# EAGLE design nes-forever (EAGLE 7.7.0)
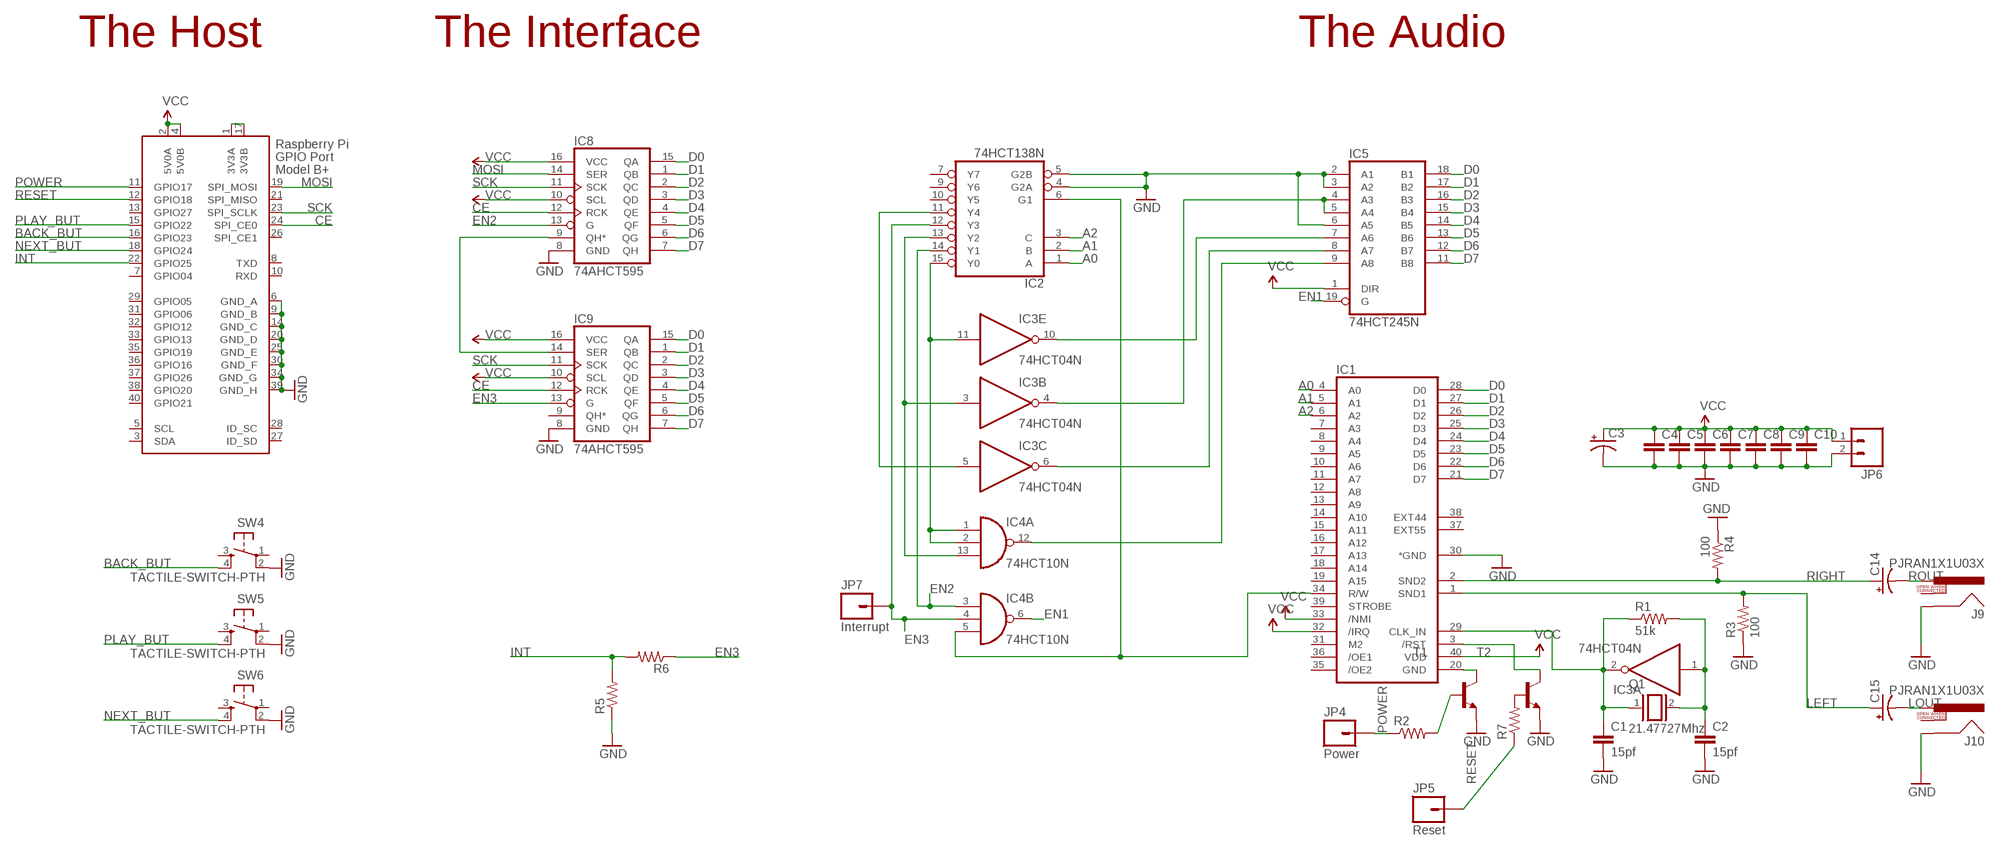
[diagram p0: schematic, sheet 1]

## Parts
C1  15pf  C-EU025-024X044  [C025-024X044]
C2  15pf  C-EU025-024X044  [C025-024X044]
C3  CPOL-USE5-8.5  [E5-8,5]
C4  C-EU025-024X044  [C025-024X044]
C5  C-EU025-024X044  [C025-024X044]
C6  C-EU025-024X044  [C025-024X044]
C7  C-EU025-024X044  [C025-024X044]
C8  C-EU025-024X044  [C025-024X044]
C9  C-EU025-024X044  [C025-024X044]
C10  C-EU025-024X044  [C025-024X044]
C14  CPOL-USE2-4  [E2-4]
C15  CPOL-USE2-4  [E2-4]
IC1  2A03  [DIL40]
IC2  74HCT138N  [DIL16]
IC3  74HCT04N  [DIL14]
IC4  74HCT10N  [DIL14]
IC5  74HCT245N  [DIL20]
IC8  74AHCT595  74LS595N  [DIL16]
IC9  74AHCT595  74LS595N  [DIL16]
J9  PJRAN1X1U03X  RCA  [RCA]
J10  PJRAN1X1U03X  RCA  [RCA]
JP4  Power  M01PTH  [1X01]
JP5  Reset  M01PTH  [1X01]
JP6  M02  [1X02_LONGPADS]
JP7  Interrupt  M01PTH  [1X01]
Q1  21.47727Mhz  XTAL  [Q]
R1  51k  R-US_0207/7  [0207/7]
R2  R-US_0207/7  [0207/7]
R3  100  R-US_0207/7  [0207/7]
R4  100  R-US_0207/7  [0207/7]
R5  R-US_0207/7  [0207/7]
R6  R-US_0207/7  [0207/7]
R7  R-US_0207/7  [0207/7]
SW4  TACTILE-SWITCH-PTH  [TAC-SWITCH-PTH]
SW5  TACTILE-SWITCH-PTH  [TAC-SWITCH-PTH]
SW6  TACTILE-SWITCH-PTH  [TAC-SWITCH-PTH]
T1  2N2222-NPN-TO92-EBC  [TO92-EBC]
T2  2N2222-NPN-TO92-EBC  [TO92-EBC]
X2  RASPI_BOARD_B+#_E4  [RASPI_BOARD_B+_EDGES_4DRILL]

## Nets
3.3V [Power]: X2.1(3V3A) X2.17(3V3B)
A0: IC1.4(A0) IC2.1(A)
A1: IC1.5(A1) IC2.2(B)
A2: IC1.6(A2) IC2.3(C)
A3: IC3.4(B:O) IC5.4(A3) IC5.5(A4)
BACK_BUT: SW4.4 X2.16(GPIO23)
CE: IC8.12(RCK) IC9.12(RCK) X2.24(SPI_CE0)
D0: IC1.28(D0) IC5.18(B1) IC8.15(QA) IC9.15(QA)
D1: IC1.27(D1) IC5.17(B2) IC8.1(QB) IC9.1(QB)
D2: IC1.26(D2) IC5.16(B3) IC8.2(QC) IC9.2(QC)
D3: IC1.25(D3) IC5.15(B4) IC8.3(QD) IC9.3(QD)
D4: IC1.24(D4) IC5.14(B5) IC8.4(QE) IC9.4(QE)
D5: IC1.23(D5) IC5.13(B6) IC8.5(QF) IC9.5(QF)
D6: IC1.22(D6) IC5.12(B7) IC8.6(QG) IC9.6(QG)
D7: IC1.21(D7) IC5.11(B8) IC8.7(QH) IC9.7(QH)
EN1: IC4.6(B:O) IC5.19(G)
EN2: IC2.14(Y1) IC4.3(B:I0) IC8.13(G)
EN3: IC2.12(Y3) IC4.4(B:I1) IC9.13(G) JP7.1 R6.1
GND [Power]: C1.2 C2.2 C3.- C4.2 C5.2 C6.2 C7.2 C8.2 C9.2 C10.2 IC1.30(*GND) IC2.4(G2A) IC2.5(G2B) IC5.2(A1) IC5.3(A2) IC5.6(A5) IC8.8(GND) IC9.8(GND) J9.SHELL J10.SHELL JP6.2 R3.1 R4.1 R5.1 SW4.2 SW5.2 SW6.2 T1.E T2.E X2.6(GND_A) X2.9(GND_B) X2.14(GND_C) X2.20(GND_D) X2.25(GND_E) X2.30(GND_F) X2.34(GND_G) X2.39(GND_H)
INT: R5.2 R6.2 X2.22(GPIO25)
LEFT: C15.+ IC1.1(SND1) R3.2
LOUT: C15.- J10.PIN
MOSI: IC8.14(SER) X2.19(SPI_MOSI)
N$1: IC3.10(E:O) IC5.7(A6)
N$2: R7.2 T2.B
N$3: IC3.6(C:O) IC5.8(A7)
N$4: IC2.15(Y0) IC3.11(E:I) IC4.1(A:I0) IC4.2(A:I1)
N$5: IC4.12(A:O) IC5.9(A8)
N$6: IC2.13(Y2) IC3.3(B:I) IC4.13(A:I2)
N$8: IC2.11(Y4) IC3.5(C:I)
N$9: IC1.34(R/W) IC2.6(G1) IC4.5(B:I2)
N$26: IC1.20(GND) T1.C
N$27: R2.2 T1.B
N$28: C1.1 IC1.29(CLK_IN) IC3.2(A:O) Q1.1 R1.1
N$29: C2.1 IC3.1(A:I) Q1.2 R1.2
N$31: IC1.3(/RST) T2.C
N$32: IC8.9(QH*) IC9.14(SER)
NEXT_BUT: SW6.4 X2.18(GPIO24)
PLAY_BUT: SW5.4 X2.15(GPIO22)
POWER: JP4.1 R2.1 X2.11(GPIO17)
RESET: JP5.1 R7.1 X2.12(GPIO18)
RIGHT: C14.+ IC1.2(SND2) R4.2
ROUT: C14.- J9.PIN
SCK: IC8.11(SCK) IC9.11(SCK) X2.23(SPI_SCLK)
VCC [Power]: C3.+ C4.1 C5.1 C6.1 C7.1 C8.1 C9.1 C10.1 IC1.32(/IRQ) IC1.33(/NMI) IC1.40(VDD) IC5.1(DIR) IC8.10(SCL) IC8.16(VCC) IC9.10(SCL) IC9.16(VCC) JP6.1 X2.2(5V0A) X2.4(5V0B)
Unconnected: IC1.7(A3) IC1.8(A4) IC1.9(A5) IC1.10(A6) IC1.11(A7) IC1.12(A8) IC1.13(A9) IC1.14(A10) IC1.15(A11) IC1.16(A12) IC1.17(A13) IC1.18(A14) IC1.19(A15) IC1.31(M2) IC1.35(/OE2) IC1.36(/OE1) IC1.37(EXT55) IC1.38(EXT44) IC1.39(STROBE) IC2.7(Y7) IC2.9(Y6) IC2.10(Y5) IC3.8(D:O) IC3.9(D:I) IC3.12(F:O) IC3.13(F:I) IC4.8(C:O) IC4.9(C:I0) IC4.10(C:I1) IC4.11(C:I2) IC9.9(QH*) J9.SWITCH J10.SWITCH SW4.1 SW4.3 SW5.1 SW5.3 SW6.1 SW6.3 X2.3(SDA) X2.5(SCL) X2.7(GPIO04) X2.8(TXD) X2.10(RXD) X2.13(GPIO27) X2.21(SPI_MISO) X2.26(SPI_CE1) X2.27(ID_SD) X2.28(ID_SC) X2.29(GPIO05) X2.31(GPIO06) X2.32(GPIO12) X2.33(GPIO13) X2.35(GPIO19) X2.36(GPIO16) X2.37(GPIO26) X2.38(GPIO20) X2.40(GPIO21)

## Notes on the sheet
- The Host | The Interface | The Audio

## Power pins joined to a net without a drawn wire
GND: IC2.8(GND) IC3.7(P:GND) IC4.7(P:GND) IC5.10(GND)
VCC: IC2.16(VCC) IC3.14(P:VCC) IC4.14(P:VCC) IC5.20(VCC)

## Library data of the parts
C1 C2 C4-C10 = rcl:C-EU: CAPACITOR, European symbol
C3 = rcl:CPOL-US: POLARIZED CAPACITOR, American symbol
C14 C15 = resistor:CPOL-US: POLARIZED CAPACITOR, American symbol
IC1 = nin:2A03: MICROCONTROLLER
IC2 = 74xx-eu:74*138: 3-line to 8-line DECODER/DEMULTIPLEXER
IC3 = 74xx-eu:74*04: Hex INVERTER
IC4 = 74xx-eu:74*10: Triple 3-input NAND gate
IC5 = 74xx-eu:74*245: Octal BUS TRANSCEIVER, 3-state
IC8 IC9 = SparkFun-DigitalIC:74*595: 8-bit SHIFT REGISTER, output latch
J9 J10 = SparkFun-Connectors:RCA
JP4 JP5 JP7 = SparkFun:M01: Header 1 Standard 1-pin 0.1" header. Use with straight break away headers (SKU : PRT-00116), right angle break away headers (PRT-00553), swiss pins (PRT-00743), machine pins (PRT-00117), and female headers (PRT-00115).
JP6 = SparkFun:M02: Header 2 Standard 2-pin 0.1" header. Use with straight break away headers (SKU : PRT-00116), right angle break away headers (PRT-00553), swiss pins (PRT-00743), machine pins (PRT-00117), and female headers (PRT-00115). Molex polarized connector foot print use with SKU : PRT-08233 with associated crimp pins and housings.
Q1 = special:XTAL: CRYSTAL
R1-R7 = resistor:R-US_: RESISTOR, American symbol
SW4-SW6 = GeekAmmo:TACTILE-SWITCH: Tactile Switch 4 Pins, SPST NO
T1 T2 = transistor-neu-to92:*-NPN-: NPN Transistror
X2 = raspberrypi_bastelstube_v13:RASPI_BOARD_B+#: Raspberry Pi GPIO connector with markings for the outer dimensions of the Raspberry Pi board model B+ with different sets of drill holes or mounting pads All pins connected

## Net classes
1 Power: width 0.305 mm

## Board
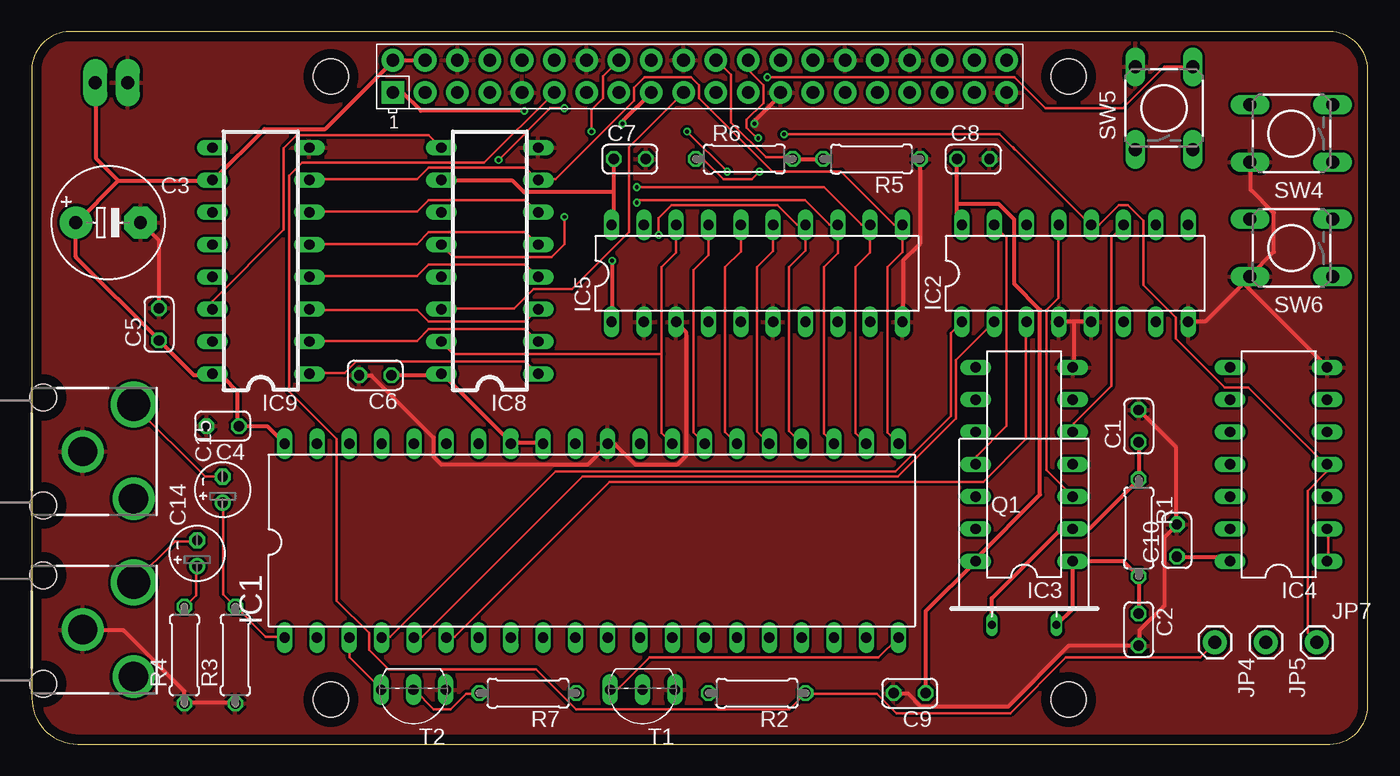
[diagram p1: board, top side]
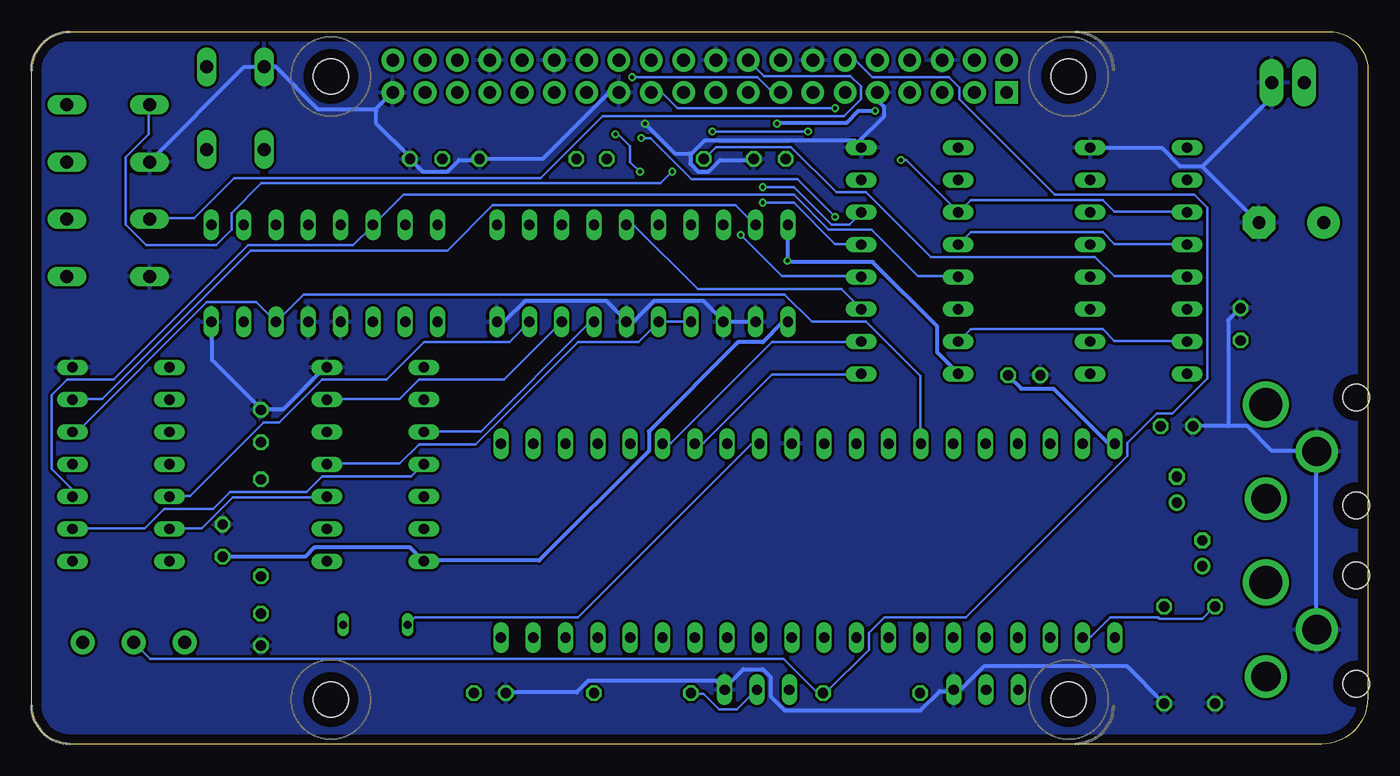
[diagram p2: board, bottom side, seen from below]

Size 105 x 56 mm. Coordinates in mm from the lower left corner, seen from the top.
Outline: 102,56 3,56 arc90 0,53 0,3.61 arc90 3.61,0 102,0 arc90 105,3 105,53 arc90 102,56
Copper layers (1*16): Top 0.035mm / dielectric 1.5mm / Bottom 0.035mm
Design rules "MF_Standard_2_Layer *": minimum track width 8mil, minimum drill 12mil, track to track 8mil, track to pad 8mil, pad to pad 8mil, via to via 8mil, smd to smd 0mil, copper to edge 30mil, drill to drill 30mil, minimum pad ring 6mil, minimum via ring 6mil, stop-mask expansion 2mil, vias tented up to drill 25mil, thermal gap 10mil

### Footprints (pad centres in the part's own frame; a part is rotated, then mirrored left to right if it is on the bottom)
C025-024X044 = drill 0.813 octagon: 1 -1.27,0; 2 1.27,0
E5-8,5 = drill 1.016 pad 2.54: + -2.54,0 | drill 1.016 pad 2.54 octagon: - 2.54,0
E2-4 = drill 0.813 pad 1.27: + -1.016,0 | drill 0.813 pad 1.27 octagon: - 1.016,0
DIL40 = drill 0.813 long: 1 -24.13,-7.62; 2 -21.59,-7.62; 3 -19.05,-7.62; 4 -16.51,-7.62; 5 -13.97,-7.62; 6 -11.43,-7.62; 7 -8.89,-7.62; 8 -6.35,-7.62; 9 -3.81,-7.62; 10 -1.27,-7.62; 11 1.27,-7.62; 12 3.81,-7.62; 13 6.35,-7.62; 14 8.89,-7.62; 15 11.43,-7.62; 16 13.97,-7.62; 17 16.51,-7.62; 18 19.05,-7.62; 19 21.59,-7.62; 20 24.13,-7.62; 21 24.13,7.62; 22 21.59,7.62; 23 19.05,7.62; 24 16.51,7.62; 25 13.97,7.62; 26 11.43,7.62; 27 8.89,7.62; 28 6.35,7.62; 29 3.81,7.62; 30 1.27,7.62; 31 -1.27,7.62; 32 -3.81,7.62; 33 -6.35,7.62; 34 -8.89,7.62; 35 -11.43,7.62; 36 -13.97,7.62; 37 -16.51,7.62; 38 -19.05,7.62; 39 -21.59,7.62; 40 -24.13,7.62
DIL16 = drill 0.813 long: 1 -8.89,-3.81; 2 -6.35,-3.81; 3 -3.81,-3.81; 4 -1.27,-3.81; 5 1.27,-3.81; 6 3.81,-3.81; 7 6.35,-3.81; 8 8.89,-3.81; 9 8.89,3.81; 10 6.35,3.81; 11 3.81,3.81; 12 1.27,3.81; 13 -1.27,3.81; 14 -3.81,3.81; 15 -6.35,3.81; 16 -8.89,3.81
DIL14 = drill 0.813 long: 1 -7.62,-3.81; 2 -5.08,-3.81; 3 -2.54,-3.81; 4 0,-3.81; 5 2.54,-3.81; 6 5.08,-3.81; 7 7.62,-3.81; 8 7.62,3.81; 9 5.08,3.81; 10 2.54,3.81; 11 0,3.81; 12 -2.54,3.81; 13 -5.08,3.81; 14 -7.62,3.81
DIL20 = drill 0.813 long: 1 -11.43,-3.81; 2 -8.89,-3.81; 3 -6.35,-3.81; 4 -3.81,-3.81; 5 -1.27,-3.81; 6 1.27,-3.81; 7 3.81,-3.81; 8 6.35,-3.81; 9 8.89,-3.81; 10 11.43,-3.81; 11 11.43,3.81; 12 8.89,3.81; 13 6.35,3.81; 14 3.81,3.81; 15 1.27,3.81; 16 -1.27,3.81; 17 -3.81,3.81; 18 -6.35,3.81; 19 -8.89,3.81; 20 -11.43,3.81
RCA = drill 2.6: PIN 4,3.7 | drill 2.3: SHELL 0,0; SWITCH 4,-3.7 | hole 2.1: -3.1,4.25; -3.1,-4.25
1X01 = drill 1.016 pad 1.88: 1 0,0
1X02_LONGPADS = drill 1.016 pad 1.88 long: 1 0,0; 2 2.54,0
Q = drill 0.61 long: 1 -2.54,-7.62; 2 2.54,-7.62
0207/7 = drill 0.813 octagon: 1 -3.81,0; 2 3.81,0
TAC-SWITCH-PTH = drill 1.016 pad 1.524 long: 1 -3.251,2.261; 2 3.251,2.261; 3 -3.251,-2.261; 4 3.251,-2.261
TO92-EBC = drill 0.813 long: B 0,-1.27; C 2.54,-1.27; E -2.54,-1.27
RASPI_BOARD_B+_EDGES_4DRILL = drill 1 pad 1.778 square: 1 8.37,51.23 | drill 1 pad 1.778: 2 8.37,53.77; 3 10.91,51.23; 4 10.91,53.77; 5 13.45,51.23; 6 13.45,53.77; 7 15.99,51.23; 8 15.99,53.77; 9 18.53,51.23; 10 18.53,53.77; 11 21.07,51.23; 12 21.07,53.77; 13 23.61,51.23; 14 23.61,53.77; 15 26.15,51.23; 16 26.15,53.77; 17 28.69,51.23; 18 28.69,53.77; 19 31.23,51.23; 20 31.23,53.77; 21 33.77,51.23; 22 33.77,53.77; 23 36.31,51.23; 24 36.31,53.77; 25 38.85,51.23; 26 38.85,53.77; 27 41.39,51.23; 28 41.39,53.77; 29 43.93,51.23; 30 43.93,53.77; 31 46.47,51.23; 32 46.47,53.77; 33 49.01,51.23; 34 49.01,53.77; 35 51.55,51.23; 36 51.55,53.77; 37 54.09,51.23; 38 54.09,53.77; 39 56.63,51.23; 40 56.63,53.77 | hole 2.75: 3.5,3.5; 3.5,52.5; 61.5,3.5; 61.5,52.5

### Placement (x,y rotation side)
C1  87,25 90 top
C2  87,9 270 top
C3  6,41 0 top
C4  15,25 180 top
C5  10,33 90 top
C6  27,29 180 top
C7  47,46 0 top
C8  74,46 0 top
C9  69,4 180 top
C10  90,16 90 top
C14  13,15 90 top
C15  15,20 90 top
IC1  44,16 0 top
IC2  82,37 0 top
IC3  78,22 90 top
IC4  98,22 90 top
IC5  57,37 0 top
IC8  36,38 90 top
IC9  18,38 90 top
J9  4,9 0 top
J10  4,23 0 top
JP4  93,8 270 top
JP5  97,8 270 top
JP6  5,52 0 top
JP7  101,8 0 top
Q1  78,17 0 top
R1  87,17 270 top
R2  57,4 180 top
R3  16,7 90 top
R4  12,7 90 top
R5  66,46 180 top
R6  56,46 0 top
R7  39,4 180 top
SW4  99,48 180 top
SW5  89,50 90 top
SW6  99,39 180 top
T1  48,3 180 top
T2  30,3 180 top
X2  20,0 0 top

### Tracks (layer width: path | path; a pad name or v marks a point on that pad's centre or on a via)
3.3V  (via drill 0.3)
  Top 0.305: v38.71,49.78 30.58,49.78 29.16,51.21 28.45,51.21 X2.1 | v46.43,48.77 46.43,48.97 X2.17
  Bottom 0.305: v38.71,49.78 40.03,49.78 40.95,48.87 46.33,48.87 v46.43,48.77
A0
  Top 0.203: IC1.4 27.53,8.43 28.14,8.43 41.15,21.44 67.87,21.44 72.24,25.81 72.24,32.31 73.05,33.12 IC2.1
A1
  Top 0.203: IC1.5 30.07,8.43 30.68,8.43 43.28,21.03 68.07,21.03 72.64,25.6 72.64,30.18 75.59,33.12 IC2.2
A2
  Top 0.203: IC1.6 32.61,8.43 33.22,8.43 45.41,20.62 74.78,20.62 78.13,23.98 78.13,33.12 IC2.3
A3
  Bottom 0.203: IC5.4 53.24,33.22 55.68,33.22 IC5.5 55.78,33.12 57.3,31.6 62.08,31.6 70.1,23.57 74.57,23.57 76.1,22.05 81.79,22.05 IC3.4
BACK_BUT  (via drill 0.3)
  Top 0.203: v51.51,48.16 v54.66,45.01 | v43.99,48.16 43.99,49.89 44.91,50.8 44.91,52.53 X2.16
  Bottom 0.203: v54.66,45.01 55.58,44.09 86.97,44.09 89.31,41.76 89.31,40.44 90.53,39.22 96.01,39.22 97.64,40.84 97.64,46.13 95.81,47.95 95.81,50.19 SW4.4 | v43.99,48.16 v51.51,48.16
CE  (via drill 0.3)
  Top 0.203: v57.1,47.65 57,47.65 56.19,48.46 56.19,49.07 57.51,50.39 57.51,51.82 56.39,52.93 56.39,53.75 X2.24 | v41.86,41.45 41.86,39.32 40.84,38.3 33.12,38.3 32.21,39.22 IC8.12
  Bottom 0.203: IC9.12 14.22,39.32 19.91,39.32 20.83,40.23 31.19,40.23 32.11,39.32 IC8.12 | v57.1,47.65 56.39,47.65 53.14,44.4 44.81,44.4 v41.86,41.45
D0
  Top 0.203: IC1.28 49.5,24.47 49.5,30.68 | 49.5,30.68 49.5,37.5 50.65,38.65 IC5.18 | 49.5,30.68 33.12,30.68 32.21,31.6 IC8.15
  Bottom 0.203: IC9.15 14.22,31.7 19.91,31.7 20.83,32.61 31.19,32.61 32.11,31.7 IC8.15
D1
  Top 0.203: IC1.27 52,24.51 52,37.25 53.19,38.44 IC5.17 | IC9.1 21.84,29.16 24.59,29.16 25.5,30.07 38.81,30.07 39.73,29.16 IC8.1
  Bottom 0.203: IC1.27 52.83,23.67 52.22,23.67 46.84,29.06 39.83,29.06 IC8.1
D2
  Top 0.203: IC1.26 54.5,24.55 54.5,37.5 55.73,38.73 IC5.16 | IC9.2 21.84,31.7 30.28,31.7 31.19,32.61 38.81,32.61 39.73,31.7 IC8.2
  Bottom 0.203: IC1.26 55.37,23.67 54.76,23.67 46.84,31.6 39.83,31.6 IC8.2
D3
  Top 0.203: IC1.25 57,24.59 57,37.5 58.27,38.77 IC5.15 | IC9.3 21.84,34.14 30.28,34.14 31.19,33.22 38.81,33.22 39.73,34.14 IC8.3
  Bottom 0.203: IC5.15 58.22,40.74 57.61,40.74 52.63,35.76 41.35,35.76 39.83,34.24 IC8.3
D4  (via drill 0.3)
  Top 0.203: IC1.24 59.5,24.63 59.5,37.5 60.81,38.81 IC5.14 60.76,40.84 60.15,40.84 58.62,42.37 50.29,42.37 49.28,41.35 v49.28,40.03 | IC9.4 21.84,36.78 30.28,36.78 31.19,37.69 38.81,37.69 39.73,36.78 IC8.4
  Bottom 0.203: v49.28,40.03 46.02,36.78 39.83,36.78 IC8.4
D5  (via drill 0.3)
  Top 0.203: IC1.23 62.25,24.42 62.25,37.5 63.35,38.6 IC5.13 63.3,40.84 62.69,40.84 60.76,42.77 47.75,42.77 v47.55,42.57 | IC9.5 21.84,39.32 30.28,39.32 31.19,40.23 38.81,40.23 39.73,39.32 IC8.5
  Bottom 0.203: v47.55,42.57 45.11,42.57 41.86,39.32 39.83,39.32 IC8.5
D6  (via drill 0.3)
  Top 0.203: IC1.22 64.75,24.46 64.75,37.5 65.89,38.64 IC5.12 65.84,40.84 65.23,40.84 62.28,43.79 v47.55,43.79 | IC9.6 21.84,41.86 30.28,41.86 31.19,42.77 38.81,42.77 39.73,41.86 IC8.6
  Bottom 0.203: v47.55,43.79 45.11,43.79 42.16,40.84 40.74,40.84 39.83,41.76 IC8.6
D7
  Top 0.203: IC1.21 67.25,24.5 67.25,37.5 68.43,38.68 IC5.11 68.38,40.84 67.77,40.84 63.6,45.01 58.22,45.01 52.43,50.8 52.43,51.82 51.82,52.43 48.16,52.43 47.35,51.61 47.35,50.6 41.15,44.4 39.83,44.4 IC8.7 39.73,44.4 38.81,45.31 31.19,45.31 30.28,44.4 21.84,44.4 IC9.7
EN1
  Bottom 0.203: IC4.6 101.8,27.13 99.47,27.13 87.78,38.81 72.34,38.81 68.78,42.37 49.68,42.37 48.16,40.84 IC5.19
EN2
  Bottom 0.203: IC8.13 32.21,36.78 35.36,36.78 39.01,40.44 42.37,40.44 45.11,43.18 75.79,43.18 78.13,40.84 IC2.14 78.23,40.74 79.76,39.22 87.99,39.22 98.55,28.65 102.21,28.65 103.43,27.43 103.43,21.64 101.91,20.12 101.91,19.51 IC4.3
EN3  (via drill 0.3)
  Top 0.203: JP7.1 100.99,8.03 100.28,8.74 100.28,19.91 101.8,21.44 101.8,21.95 IC4.4 101.7,21.95 95.61,28.04 93.78,28.04 89.92,31.9 89.92,33.53 87.38,36.07 87.38,41.15 86.16,42.37 85.45,42.37 83.92,40.84 83.31,40.84 IC2.12 83.21,40.84 77.11,46.94 77.25,46.75 76.06,47.94 v59.13,47.94 | v57.2,45.01 56.59,44.4 54.36,44.4 52.83,45.92 52.22,45.92 R6.1
  Bottom 0.203: IC9.13 14.22,36.78 19.91,36.78 21.44,38.3 34.34,38.3 39.42,43.38 41.76,43.38 45.31,46.94 51.21,46.94 52.12,46.02 R6.1 | v59.13,47.94 58.94,47.94 58,47 58,45.75 v57.2,45.01
GND  (via drill 0.3)
  Top 0.305: IC5.3 50.7,33.12 51.41,32.41 51.41,22.66 50.7,21.95 47.45,21.95 45.82,23.57 45.31,23.57 IC1.30 45.21,23.47 43.69,21.95 32.21,21.95 31.6,22.55 31.6,24.08 26.72,28.96 25.81,28.96 C6.2 | v56.79,48.77 56.79,48.97 58.83,51 58.83,51.21 X2.25 | IC5.10 68.48,33.22 68.48,38 69.8,39.32 69.8,45.92 R5.1 | R3.1 15.95,3.25 12.09,3.25 R4.1 11.99,3.35 11.99,4.17 7.21,8.94 4.06,8.94 J9.SHELL | C5.2 9.96,34.34 9.96,39.62 8.64,40.95 C3.- | IC2.8 90.93,33.22 92.25,33.22 95.71,36.68 SW6.2 | IC4.7 101.8,29.67 95.3,36.17 SW6.2 | SW4.2 95.81,45.72 95.81,43.59 97.64,41.76 97.64,38.71 95.81,36.88 SW6.2 | 81.89,33.22 83.21,33.22 IC2.5 | 81.89,33.22 80.77,33.22 IC2.4 | 81.89,33.22 81.89,29.67 IC3.7 | C1.2 87.07,26.21 89.92,23.37 89.92,17.37 C10.2 89.92,17.17 89,16.26 89,10.87 87.07,8.94 87.07,7.82 C2.2 86.87,7.72 81.48,7.72 76.71,2.95 69.9,2.95 68.89,3.96 67.77,3.96 C9.2
  Bottom 0.305: IC5.2 48.16,33.22 50.6,33.22 IC5.3 50.7,33.33 52.22,34.85 56.08,34.85 57.71,33.22 58.22,33.22 IC5.6 58.32,33.33 59.84,34.85 66.24,34.85 67.87,33.22 68.38,33.22 IC5.10 | 53.24,46.33 53.24,45.62 52.63,45.01 51.82,45.01 50.9,45.92 48.36,45.92 C7.2 | 53.24,46.33 52.12,47.45 40.34,47.45 39.83,46.94 IC8.8 40.03,47.35 38,49.38 38,50.09 38.51,50.6 38.51,51.21 X2.9 | 78.03,49.89 82.5,49.89 85.85,53.24 86.67,53.24 SW5.2 86.87,53.24 88.29,53.24 95.71,45.82 SW4.2 | 78.03,49.89 76.71,51.21 X2.39 | X2.25 58.93,51.21 59.64,51.21 64.82,46.02 69.7,46.02 R5.1 69.9,45.92 71.42,45.92 72.34,45.01 74.27,45.01 75.18,45.92 C8.2 75.29,46.13 77.93,48.77 77.93,49.78 78.03,49.89 | v56.79,48.77 54.46,46.43 53.34,46.43 53.24,46.33 | R3.1 16.05,3.25 18.9,6.1 30.18,6.1 31.9,4.37 32.51,4.37 T2.E 32.61,4.17 33.63,4.17 35.15,2.64 45.82,2.64 46.94,3.76 46.94,5.28 47.55,5.89 49.07,5.89 50.49,4.47 T1.E 50.6,4.37 51.21,4.98 61.27,4.98 62.18,4.06 67.67,4.06 C9.2 | 10.97,24.99 9.45,24.99 7.52,23.06 4.06,23.06 J10.SHELL 4.06,22.86 4.06,9.04 J9.SHELL | 10.97,24.99 13.72,24.99 C4.2 | 13.01,45.41 14.73,45.41 16.15,46.84 21.74,46.84 IC9.8 | 13.01,45.41 8.64,41.05 C3.- | 13.01,45.41 7.62,50.8 7.62,51.92 JP6.2 | 10.97,24.99 10.97,33.33 10.06,34.24 C5.2 | IC3.7 81.89,29.67 85.24,26.31 86.97,26.31 C1.2 87.07,26.42 90.83,30.18 90.83,33.12 IC2.8
  pour Top: 0,56 105,56 105,0 0,0
  pour Bottom: 0,56 105,56 105,0 0,0
INT
  Top 0.203: R6.2 59.74,46.13 57.71,46.13 54.97,48.87 54.97,52.63 53.85,53.75 X2.22
  Top 0.305: R6.2 R5.2
LEFT
  Top 0.203: IC1.1 19.81,8.43 18.39,8.43 16.05,10.77 R3.2 15.95,10.87 15.04,11.79 15.04,18.9 C15.+
LOUT
  Top 0.203: C15.- 14.94,21.03 13.61,21.03 8.03,26.62 J10.PIN
MOSI
  Top 0.203: X2.19 46.94,46.94 46.94,40.23 42.47,35.76 39.42,35.76 37.9,34.24 32.21,34.24 IC8.14
N$1
  Bottom 0.203: IC3.10 74.17,24.59 69.7,24.59 61.16,33.12 60.86,33.12 IC5.7
N$2
  Top 0.203: R7.2 35.15,3.96 34.14,3.96 32.92,2.74 31.6,2.74 30.07,4.27 T2.B
N$3
  Bottom 0.203: IC3.6 81.79,27.13 76.1,27.13 74.57,28.65 67.87,28.65 63.4,33.12 IC5.8
N$4
  Top 0.203: IC4.1 101.91,14.43 101.91,16.87 IC4.2 | IC3.11 74.27,22.05 74.27,22.66 76.61,24.99 76.61,39.83 75.69,40.74 IC2.15
  Bottom 0.203: IC4.2 101.8,16.97 96.11,16.97 94.59,18.49 90.73,18.49 89.41,19.81 83.41,19.81 82.19,21.03 75.18,21.03 74.27,21.95 IC3.11
N$5
  Bottom 0.203: IC4.12 94.18,19.51 92.56,19.51 86.77,25.3 85.55,25.3 82.19,28.65 77.11,28.65 74.17,31.6 67.46,31.6 65.94,33.12 IC5.9
N$6
  Top 0.203: IC2.13 80.67,40.74 80.67,35.05 79.76,34.14 79.76,21.54 81.79,19.51 IC3.3
  Bottom 0.203: IC4.13 94.18,16.97 91.64,16.97 89.2,19.41 81.89,19.41 IC3.3
N$8
  Top 0.203: IC3.5 81.89,24.59 81.89,25.2 84.84,28.14 84.84,39.83 85.75,40.74 IC2.11
N$9
  Bottom 0.203: IC1.34 35.15,23.67 35.15,28.96 39.42,33.22 43.69,33.22 45.82,35.36 83.62,35.36 85.75,33.22 IC2.6 85.85,33.22 87.38,34.75 91.24,34.75 101.4,24.59 101.8,24.59 IC4.5
N$26
  Top 0.203: T1.C 45.52,4.37 46.13,4.37 48.56,6.81 66.55,6.81 68.07,8.33 IC1.20
N$27
  Bottom 0.203: R2.2 53.14,3.96 52.22,3.96 51,2.74 49.58,2.74 48.06,4.27 T1.B
N$28
  Top 0.305: Q1.1 75.46,11.46 81,17 82,17 81.92,16.92 IC3.2 83.11,16.92 R1.1 C1.1
  Bottom 0.203: IC1.29 47.85,23.57 48.46,23.57 62.08,9.96 74.88,9.96 75.39,9.45 Q1.1
N$29
  Top 0.305: Q1.2 81.81,10.65 IC3.1 85.81,14.38 R1.2 C2.1
N$31
  Top 0.203: IC1.3 24.99,8.33 24.99,6.81 27.43,4.37 T2.C
N$32
  Top 0.203: IC9.14 14.22,34.24 14.22,34.85 19.81,40.44 19.81,46.84 20.83,47.85 31.19,47.85 32.11,46.94 IC8.9
NEXT_BUT
  Bottom 0.203: X2.18 47.45,52.53 40.64,52.53 39.83,51.71 39.83,50.7 41.15,49.38 60.15,49.38 65.02,44.5 89.1,44.5 92.25,41.35 95.71,41.35 SW6.4
PLAY_BUT  (via drill 0.3)
  Top 0.203: v57.81,52.43 77.22,52.43 79.65,49.99 85.75,49.99 89,53.24 91.24,53.24 SW5.4
  Bottom 0.203: v57.81,52.43 47.95,52.43 46.84,51.31 46.23,51.31 X2.15
POWER
  Top 0.203: JP4.1 92.96,7.92 91.85,6.81 81.28,6.81 76.91,2.44 67.97,2.44 66.45,3.96 60.86,3.96 R2.1 60.76,3.96 59.54,2.74 42.77,2.74 39.62,5.89 28.04,5.89 26.52,7.42 26.52,8.74 23.98,11.28 23.98,23.98 20.22,27.74 20.22,44.7 21.23,45.72 35.56,45.72 X2.11
RESET
  Bottom 0.203: JP5.1 96.93,7.92 95.71,6.71 45.92,6.71 43.28,4.06 42.88,4.06 R7.1 42.77,4.06 42.57,4.06 39.22,7.42 39.22,8.74 38,9.96 31.6,9.96 18.9,22.66 18.9,23.67 16.56,26.01 15.34,26.01 12.6,28.75 12.6,42.16 13.61,43.18 24.59,43.18 32.11,50.7 32.11,51.61 32.92,52.43 38.91,52.43 40.23,53.75 41.05,53.75 X2.12
RIGHT
  Top 0.203: C14.+ 12.9,13.92 12.9,11.68 12.09,10.87 R4.2
  Bottom 0.203: IC1.2 22.35,8.43 21.74,8.43 20.22,9.96 16.46,9.96 16.36,9.86 13.01,9.86 12.09,10.77 R4.2
ROUT
  Top 0.203: C14.- 12.9,15.95 11.28,15.95 8.03,12.7 J9.PIN
SCK  (via drill 0.3)
  Top 0.203: v41.86,49.99 40.74,49.99 v36.68,45.92
  Bottom 0.203: IC9.11 14.22,41.86 19.91,41.86 20.83,42.77 31.19,42.77 32.11,41.86 IC8.11 32.21,41.86 36.27,45.92 v36.68,45.92 | v41.86,49.99 54.25,49.99 55.47,51.21 56.29,51.21 X2.23
VCC  (via drill 0.3)
  Top 0.305: IC2.16 72.73,40.81 72.73,42.47 | 72.73,42.47 C8.1 | C10.1 94.19,14.73 IC4.14 | C9.1 70.27,10.46 IC3.14 74.17,14.53 79.25,19.61 79.25,34.14 77.22,36.17 77.22,41.25 76,42.47 72.73,42.47 | C7.1 45.73,43.38 | 45.73,43.38 45.73,40.97 IC5.20 | C6.1 32.08,29 IC8.16 32.31,29.06 37.59,23.77 IC1.33 37.69,23.67 40.13,23.67 IC1.32 | IC1.40 18.49,25 C4.1 16.15,25.09 16.15,27.74 15.04,28.85 IC9.16 14.89,29.11 15,29 12.73,29 C5.1 9.96,31.8 3.45,38.3 3.45,40.84 C3.+ 3.56,41.05 6.81,44.3 | X2.4 30.89,53.75 28.45,53.75 X2.2 28.35,53.65 23.06,48.36 18.29,48.36 14.33,44.4 IC9.10 14.12,44.3 6.81,44.3 | 6.81,44.3 5.08,46.02 5.08,51.92 JP6.1 | 45.73,43.38 38.71,43.38 37.8,44.3 32.21,44.3 IC8.10 | v45.62,38 45.62,33.22 IC5.1
  Bottom 0.305: C10.1 89.92,14.73 83.52,14.73 82.8,15.44 75.29,15.44 74.27,14.43 IC3.14 74.07,14.43 65.13,14.43 56.49,23.06 56.49,24.59 49.48,31.6 47.55,31.6 46.02,33.12 45.62,33.12 IC5.1 | IC5.20 45.62,40.74 v45.62,38 45.52,37.9 38.91,37.9 33.83,32.82 33.83,30.79 32.21,29.16 IC8.16 | IC1.40 19.91,23.67 20.42,23.67 24.69,27.94 27.23,27.94 28.25,28.96 C6.1